# EAGLE design StupidPower2 (EAGLE 7.7.0)
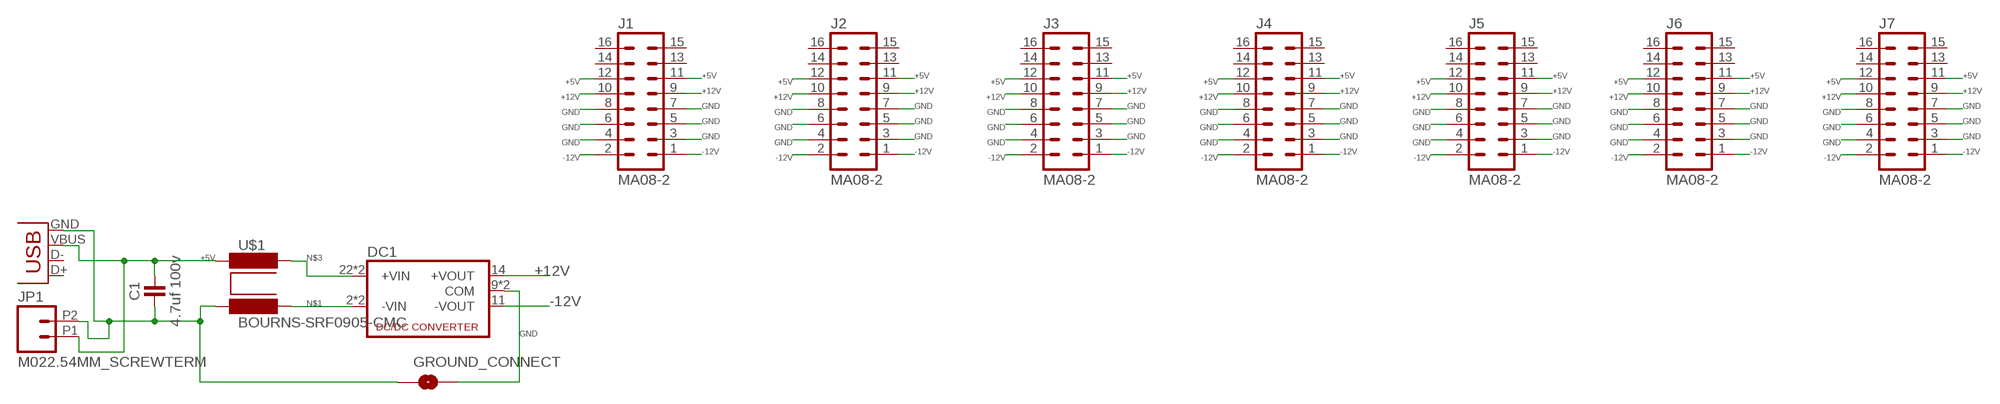
[diagram p0: schematic, sheet 1]

## Parts
C1  4.7uf 100v  CAPACITOR-1206  [C1206]
DC1  XPOWER-JCA  [XP-POWER_JCA]
GROUND_CONNECT  SOLDERJUMPERNO  [SJ_2S-NO]
J1  MA08-2  [MA08-2]
J2  MA08-2  [MA08-2]
J3  MA08-2  [MA08-2]
J4  MA08-2  [MA08-2]
J5  MA08-2  [MA08-2]
J6  MA08-2  [MA08-2]
J7  MA08-2  [MA08-2]
JP1  M022.54MM_SCREWTERM  [1X02_2.54_SCREWTERM]
JP2  USB-B  USBPTH  [USB-B-PTH]
U$1  BOURNS-SRF0905-CMC  [BOURNS-SRF0905-LINEFILTER]

## Nets
+5V: C1.2 J1.11 J1.12 J2.11 J2.12 J3.11 J3.12 J4.11 J4.12 J5.11 J5.12 J6.11 J6.12 J7.11 J7.12 JP1.P1 JP2.VBUS U$1.2
+12V: DC1.14(+VOUT) J1.9 J1.10 J2.9 J2.10 J3.9 J3.10 J4.9 J4.10 J5.9 J5.10 J6.9 J6.10 J7.9 J7.10
-12V: DC1.11(-VOUT) J1.1 J1.2 J2.1 J2.2 J3.1 J3.2 J4.1 J4.2 J5.1 J5.2 J6.1 J6.2 J7.1 J7.2
GND: DC1.9(COM) DC1.16(COM) GROUND_CONNECT.2 J1.3 J1.4 J1.5 J1.6 J1.7 J1.8 J2.3 J2.4 J2.5 J2.6 J2.7 J2.8 J3.3 J3.4 J3.5 J3.6 J3.7 J3.8 J4.3 J4.4 J4.5 J4.6 J4.7 J4.8 J5.3 J5.4 J5.5 J5.6 J5.7 J5.8 J6.3 J6.4 J6.5 J6.6 J6.7 J6.8 J7.3 J7.4 J7.5 J7.6 J7.7 J7.8
GND_INLET: C1.1 GROUND_CONNECT.1 JP1.P2 JP2.GND U$1.1
N$1: DC1.2(-VIN) DC1.3(-VIN) U$1.4
N$3: DC1.22(+VIN) DC1.23(+VIN) U$1.3
Unconnected: J1.13 J1.14 J1.15 J1.16 J2.13 J2.14 J2.15 J2.16 J3.13 J3.14 J3.15 J3.16 J4.13 J4.14 J4.15 J4.16 J5.13 J5.14 J5.15 J5.16 J6.13 J6.14 J6.15 J6.16 J7.13 J7.14 J7.15 J7.16 JP2.D+ JP2.D-

## Library data of the parts
C1 = we-rcl:CAPACITOR: Capacitors ...2.2uF @ 6.3V -> 0402 ...4.7uF @ 6.3V -> 0603 ...10uF @ 16V -> 0805 ...22uF @ 25V -> 1206
DC1 = MTM_untested:XPOWER-JCA: DC-DC CONVERTER
GROUND_CONNECT = SparkFun-Passives:SOLDERJUMPER: Solder Jumper Standard SMD solder jumper. Used to automate production. Two varients : Normally Open and Normally Closed are the same, but have different paste layers. NC will have a large amount of paste and should jumper during reflow.
J1-J7 = we-con:MA08-2: Pin Header
JP1 = SparkFun-Connectors:M02: Standard 2-pin 0.1" header. Use with - straight break away headers ( PRT-00116) - right angle break away headers (PRT-00553) - swiss pins (PRT-00743) - machine pins (PRT-00117) - female headers (PRT-00115) Molex polarized connector foot print use with: PRT-08233 with associated crimp pins and housings. 2.54_SCREWTERM for use with PRT-10571. 3.5mm Screw Terminal footprints for PRT-08084 5mm Screw Terminal footprints for use with PRT-08433
JP2 = SparkFun-Connectors:USB: USB Connectors USB-B-PTH is fully proven SKU : PRT-00139/CONN-08278 USB-miniB is fully proven SKU : PRT-00587 USB-A-PCB is untested. USB-A-H is throughly reviewed, but untested. Spark Fun Electronics SKU : PRT-00437 USB-B-SMT is throughly reviewed, but untested. Needs silkscreen touching up. USB-A-S has not been used/tested USB-MB-H has not been used/tested USB-MICROB has been used. CONN-09505; PROD_ID: CONN-08278
U$1 = MTM_untested:BOURNS-SRF0905-CMC

## Board
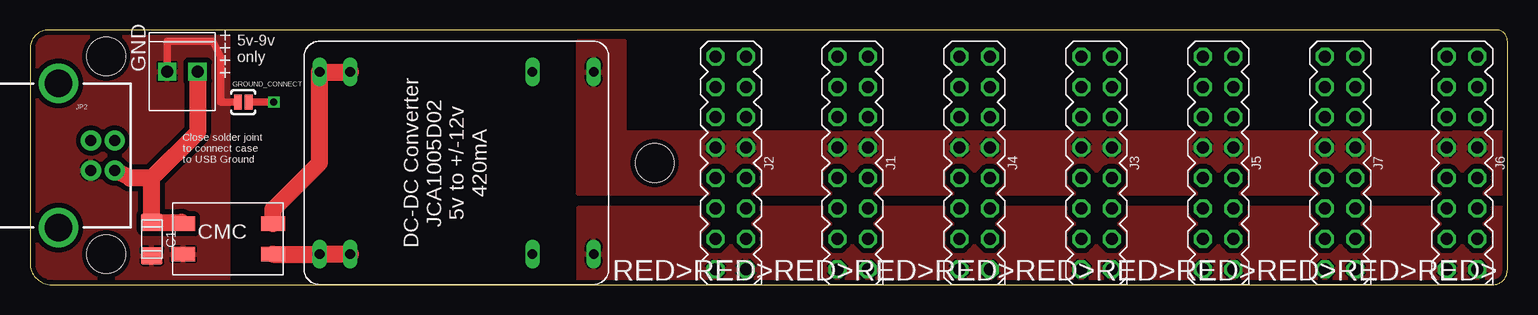
[diagram p1: board, top side]
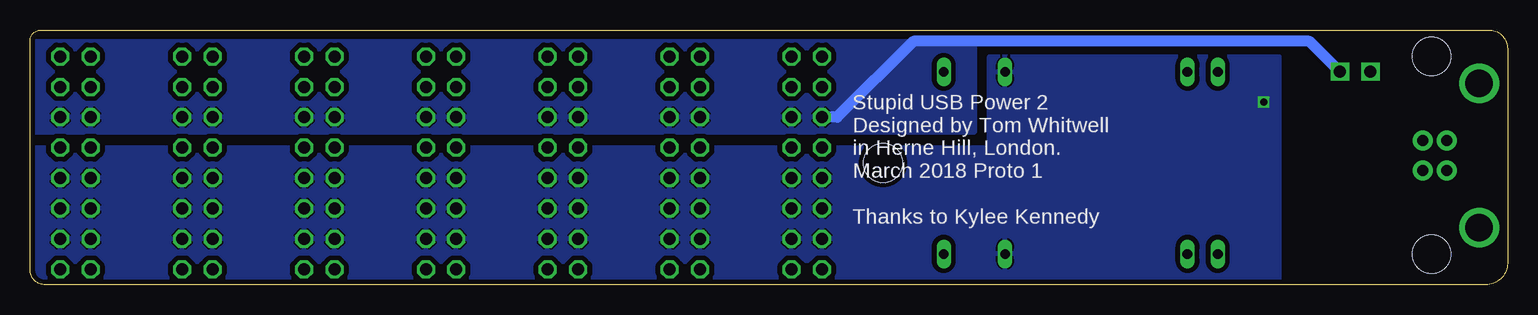
[diagram p2: board, bottom side, seen from below]

Size 123.17 x 21.26 mm. Coordinates in mm from the lower left corner, seen from the top.
Outline: 122.23,21.26 1.58,21.26 arc90 0,19.68 0,1.8 arc90 1.8,0 121.92,0 arc90 123.17,1.25 123.17,20.32 arc90 122.23,21.26
Copper layers (1*16): Top 0.0356mm / dielectric 1.5011mm / Bottom 0.0356mm
Design rules "oshpark-2layer *": minimum track width 6mil, minimum drill 13mil, track to track 6mil, track to pad 6mil, pad to pad 6mil, via to via 6mil, smd to smd 6mil, copper to edge 15mil, drill to drill 6mil, minimum pad ring 7mil, minimum via ring 7mil, stop-mask expansion 2.5mil, vias tented up to drill 0mil, thermal gap 6mil
Holes 3.2 mm at 6.35,19.05 6.35,2.54 52.07,10.16

### Footprints (pad centres in the part's own frame; a part is rotated, then mirrored left to right if it is on the bottom)
C1206 = smd 1.8 x 1.45: 1 0,1.4; 2 0,-1.4
XP-POWER_JCA = drill 0.8 long: 2 -7.6,22.84; 3 -7.6,20.3; 9 -7.6,5.1; 11 -7.6,0; 14 7.6,0; 16 7.6,5.1; 22 7.6,20.3; 23 7.6,22.84
SJ_2S-NO = smd 0.635 x 1.27: 1 -0.45,0; 2 0.45,0
MA08-2 = drill 1 octagon: 1 -1.27,8.89; 2 1.27,8.89; 3 -1.27,6.35; 4 1.27,6.35; 5 -1.27,3.81; 6 1.27,3.81; 7 -1.27,1.27; 8 1.27,1.27; 9 -1.27,-1.27; 10 1.27,-1.27; 11 -1.27,-3.81; 12 1.27,-3.81; 13 -1.27,-6.35; 14 1.27,-6.35; 15 -1.27,-8.89; 16 1.27,-8.89
1X02_2.54_SCREWTERM = drill 1.016 square: P1 2.54,0; P2 0,0
USB-B-PTH = drill 0.914 pad 1.676: D+ 0,1.25; D- 1.981,1.25; GND 0,-1.25; VBUS 1.981,-1.25 | drill 2.286: S1 -2.718,-6.02; S2 -2.718,6.02
BOURNS-SRF0905-LINEFILTER = smd 2 x 1.2: 1 -3.75,-1.27; 2 -3.75,1.27; 3 3.75,1.27; 4 3.75,-1.27

### Placement (x,y rotation side)
C1  10.16,3.81 180 top
DC1  46.99,10.16 90 top
GROUND_CONNECT  17.78,15.24 0 top
J1  68.58,10.16 180 top
J2  58.42,10.16 180 top
J3  88.9,10.16 180 top
J4  78.74,10.16 180 top
J5  99.06,10.16 180 top
J6  119.38,10.16 180 top
J7  109.22,10.16 180 top
JP1  11.43,17.78 0 top
JP2  5.08,10.79 0 top
U$1  16.51,3.81 0 top

### Tracks (layer width: path | path; a pad name or v marks a point on that pad's centre or on a via)
+5V
  Top 1.27: 12.63,5.21 U$1.2
  Top 1.422: JP1.P1 13.97,12.7 10.16,8.89 | 10.16,8.89 8.35,8.89 JP2.VBUS | 10.16,8.89 C1.2 12.63,5.21
  Bottom 0.914: JP1.P1 16.51,20.32 49.53,20.32 55.88,13.97 J2.12
  pour Bottom (isolate 0.406): 44.45,12.7 123.19,12.7 123.19,20.32 44.45,20.32
+12V
  pour Top (isolate 0.406): 45.72,7.62 45.72,20.32 49.53,20.32 49.53,12.7 123.19,12.7 123.19,7.62
-12V
  pour Top (isolate 0.406): 123.19,6.35 45.72,6.35 45.72,0 123.19,0
GND  (via drill 0.6)
  Top 0.61: GROUND_CONNECT.2 v20.32,15.24
  pour Bottom (isolate 0.406): 123.19,0 123.19,11.43 43.18,11.43 43.18,19.05 19.05,19.05 19.05,0
GND_INLET
  Top 0.61: JP1.P2 11.43,20.32 15.24,20.32 15.88,19.05 15.88,15.24 GROUND_CONNECT.1
  pour Top (isolate 0.406): 0,0 16.51,0 16.51,21.59 0,21.59
N$1
  Top 1.27: 24.13,2.54 DC1.2
  Top 1.422: U$1.4 24.13,2.54 | DC1.2 DC1.3
N$3
  Top 1.27: 24.13,17.74 DC1.23
  Top 1.422: U$1.3 20.26,6.29 24.13,10.16 24.13,17.74 | DC1.23 DC1.22

### Text on the board
tPlace: ++++ | 5v-9v / only | GND | Close solder joint / to connect case / to USB Ground | CMC | RED>RED>RED>RED>RED>RED>RED>RED>RED>RED>RED>
bPlace: Stupid USB Power 2 / Designed by Tom Whitwell / in Herne Hill, London. / March 2018 Proto 1 / / Thanks to Kylee Kennedy